# EAGLE schematic Mezzanine_Battery (EAGLE 6.5.0)

## Sheet 1 of 2
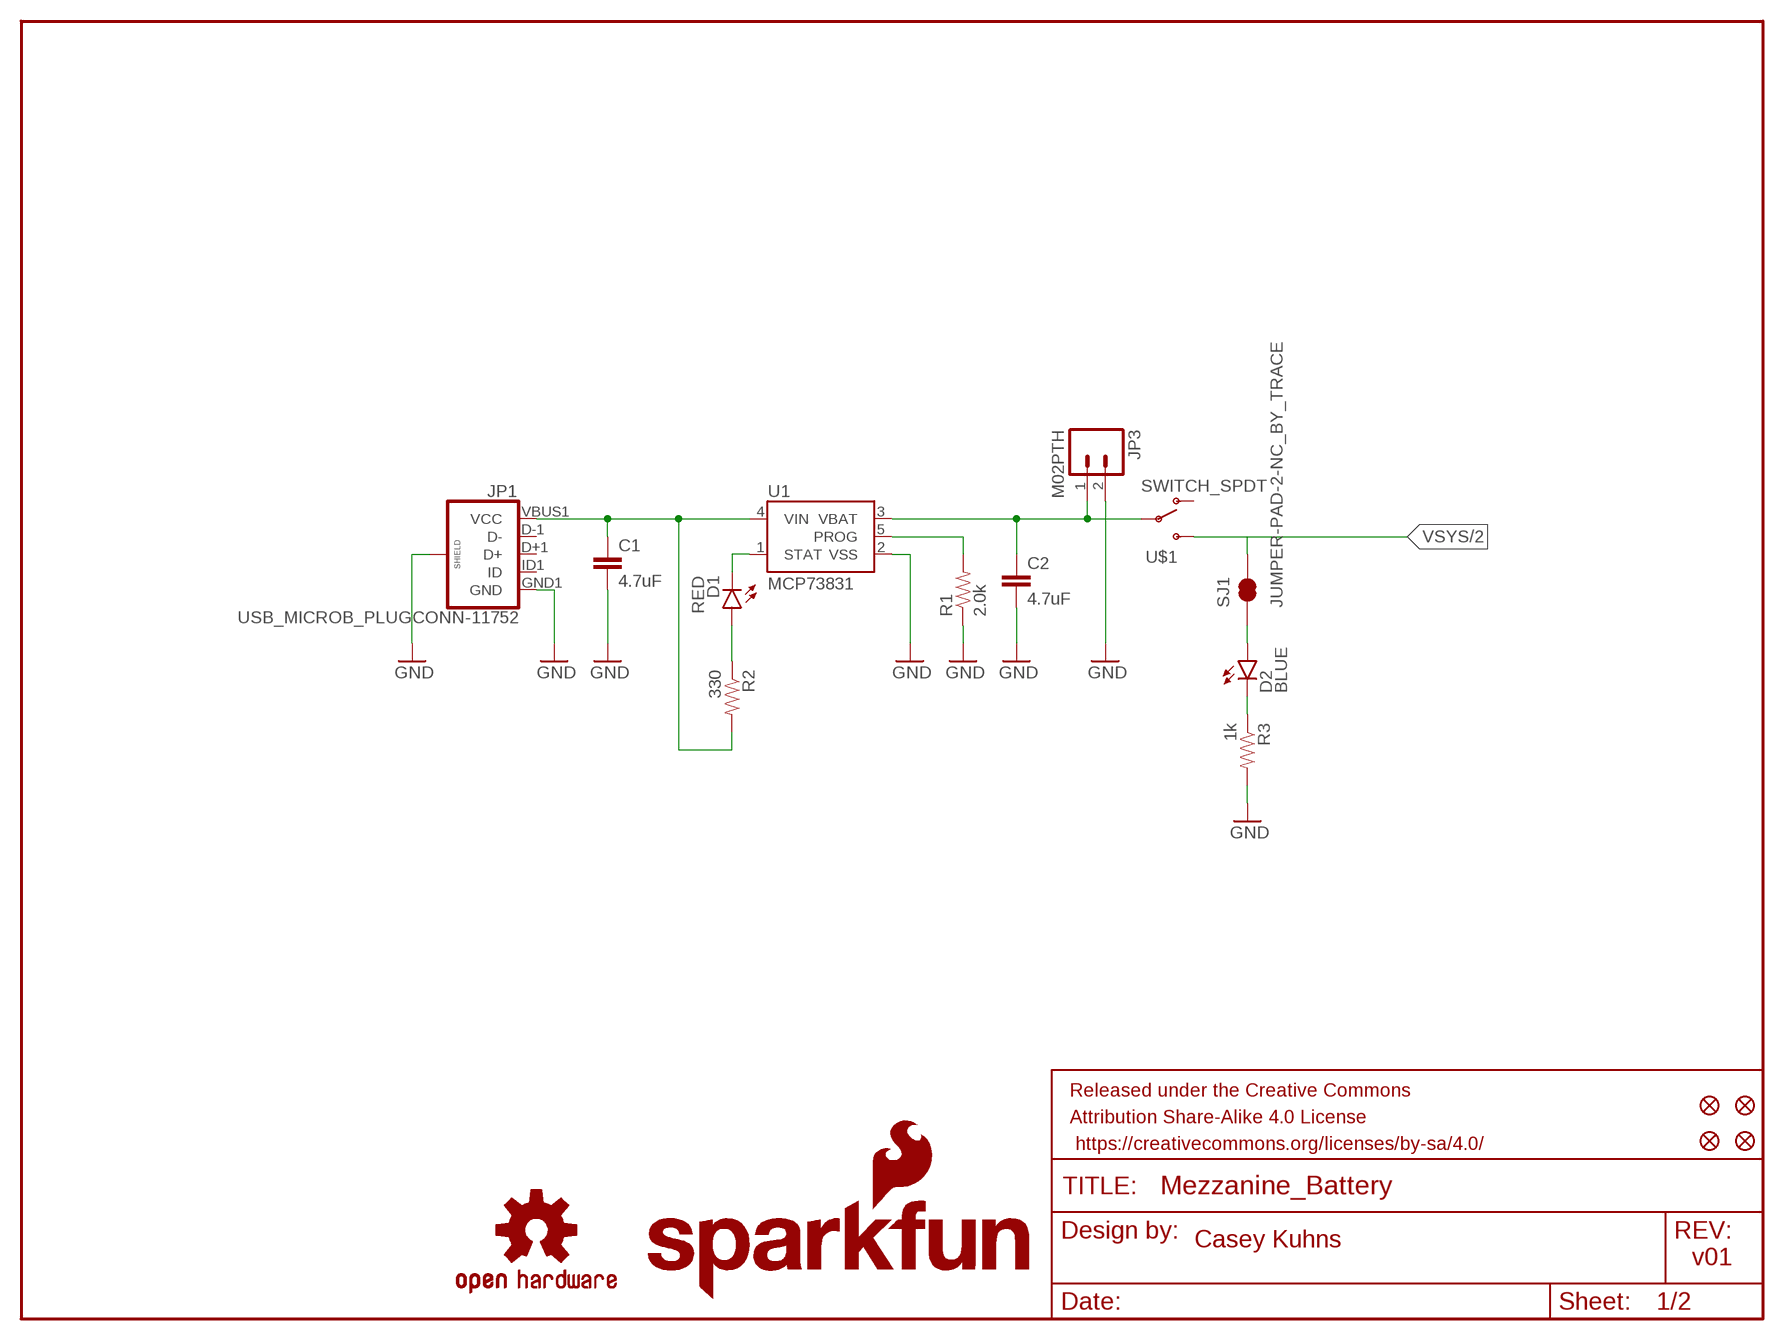
[diagram p0: schematic, sheet 1]

### Parts
C1  4.7uF  4.7UF-6.3V-10%(0603)0603  [0603-CAP]
C2  4.7uF  4.7UF-6.3V-10%(0603)0603  [0603-CAP]
D1  RED  LED-RED0603  [LED-0603]
D2  BLUE  LED-BLUE0603  [LED-0603]
FID1  FIDUCIAL1X2  [FIDUCIAL-1X2]
FID2  FIDUCIAL1X2  [FIDUCIAL-1X2]
FID3  FIDUCIAL1X2  [FIDUCIAL-1X2]
FID4  FIDUCIAL1X2  [FIDUCIAL-1X2]
FRAME1  FRAME-LETTER  [CREATIVE_COMMONS]
JP1  USB_MICROB_PLUGCONN-11752  [USB-B-MICRO-SMD_V03]
JP3  M02PTH  [1X02]
LOGO1  OSHW-LOGOS  [OSHW-LOGO-S]
LOGO4  SFE_LOGO_NAME_FLAME.1_INCH  [SFE_LOGO_NAME_FLAME_.1]
R1  2.0k  2.0KOHM1/10W5%(0603)  [0603-RES]
R2  330  330OHM1/10W1%(0603)  [0603-RES]
R3  1k  1KOHM1/10W1%(0603)  [0603-RES]
SJ1  JUMPER-PAD-2-NC_BY_TRACE  [PAD-JUMPER-2-NC_BY_TRACE_YES_SILK]
U1  MCP73831  [SOT23-5]
U$1  SWITCH_SPDT  [KPS-1290]

### Nets
GND: C1.2 C2.2 JP1.GND1(GND) JP1.SHIELD1(SHIELD) JP1.SHIELD2(SHIELD) JP1.SHIELD3(SHIELD) JP3.2 R1.1 R3.2 U1.2(VSS) ; also sheet 2
N$1: C1.1 JP1.VBUS1(VCC) R2.2 U1.4(VIN)
N$2: D2.C R3.1
N$3: R1.2 U1.5(PROG)
N$4: D1.A R2.1
N$5: D1.C U1.1(STAT)
N$6: C2.1 JP3.1 U1.3(VBAT) U$1.P
N$7: D2.A SJ1.1
VSYS: SJ1.2 U$1.S ; also sheet 2
Unconnected: JP1.D+1(D+) JP1.D-1(D-) JP1.ID1(ID) U$1.O

### Notes on the sheet
- Casey Kuhns
- v01

## Sheet 2 of 2
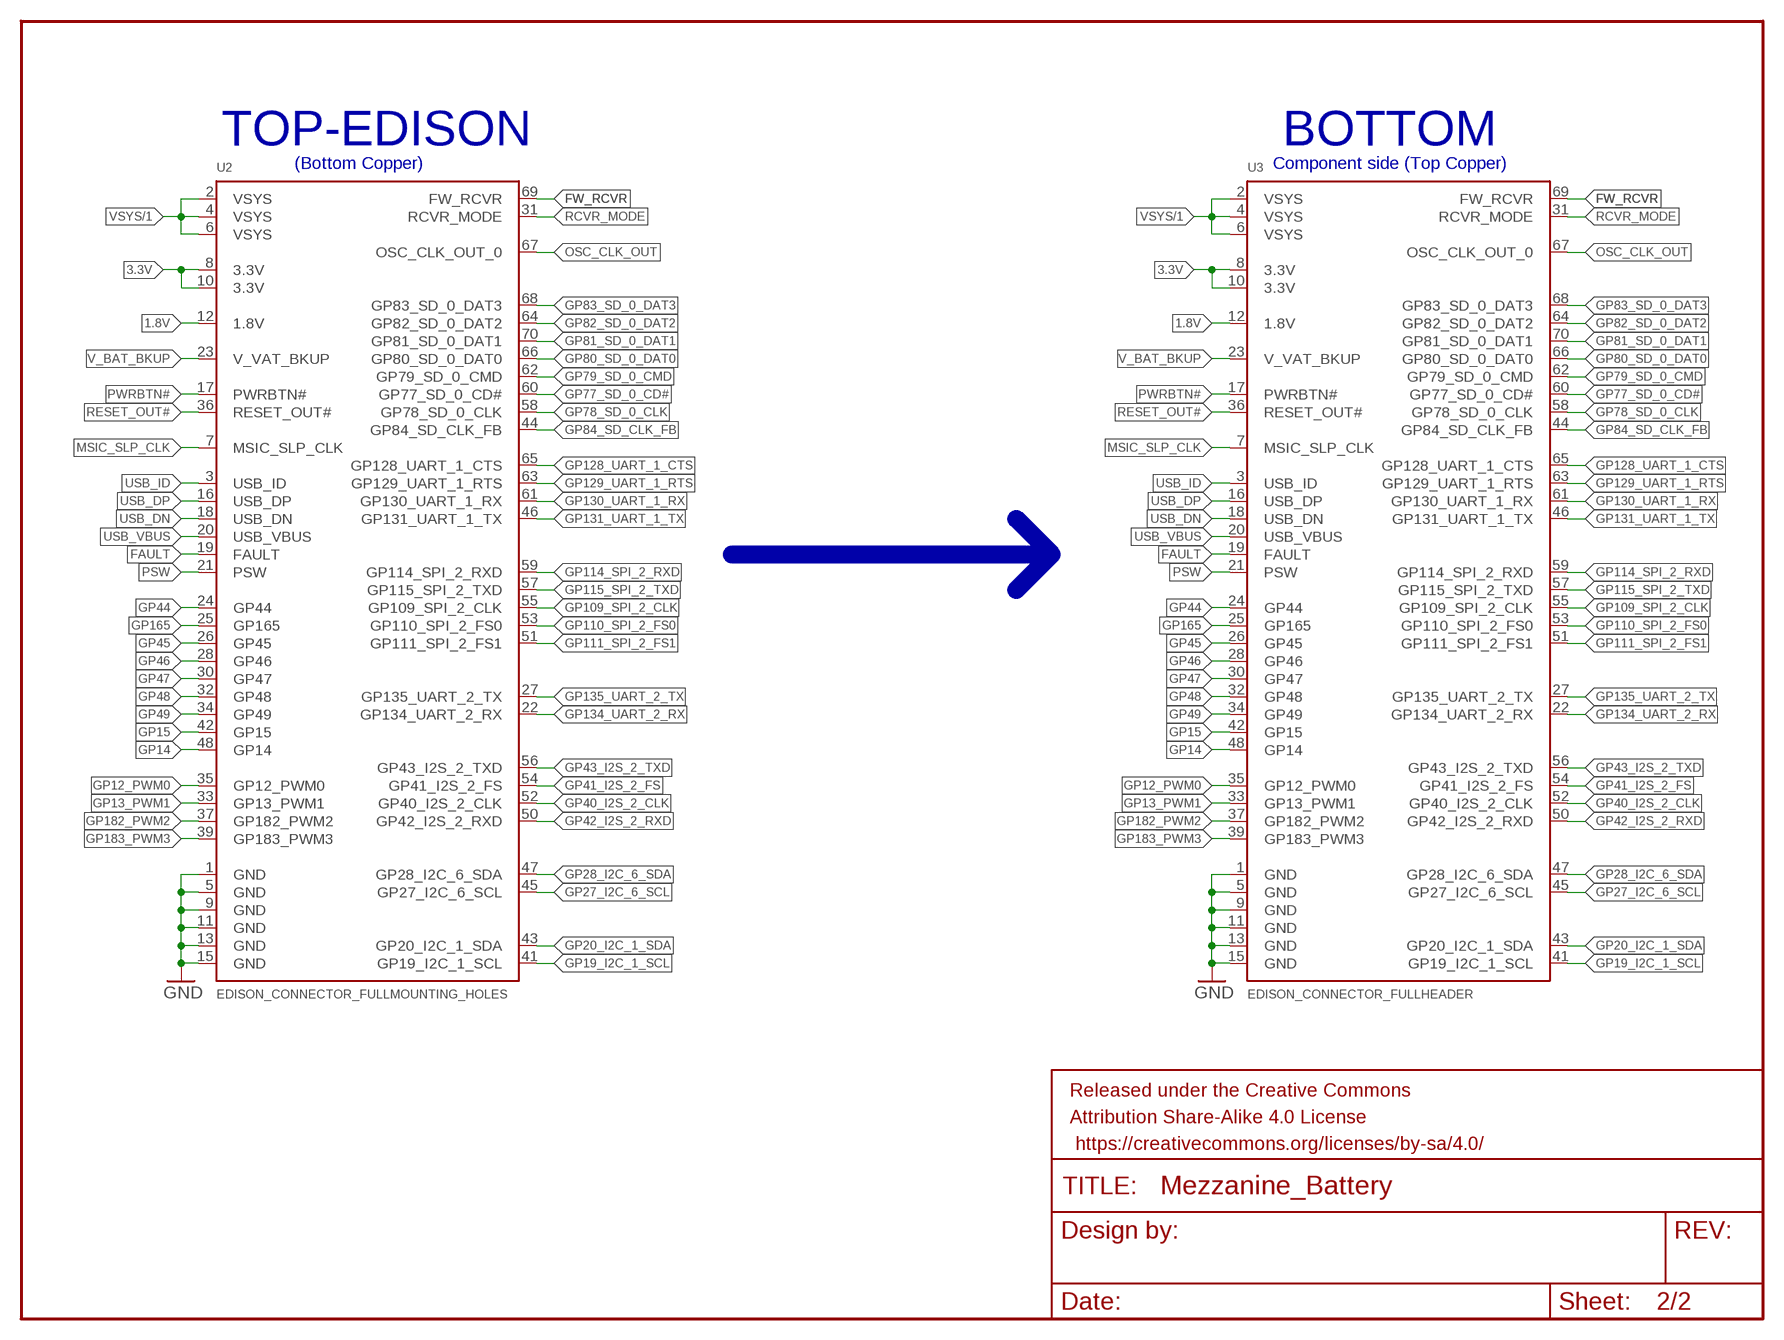
[diagram p1: schematic, sheet 2]

### Parts
FRAME2  FRAME-LETTER  [CREATIVE_COMMONS]
U2  EDISON_CONNECTOR_FULLMOUNTING_HOLES  [EDISON_DAUGHTER]
U3  EDISON_CONNECTOR_FULLHEADER  [DF40C-70DP-0.4(51)]

### Nets
1.8V: U2.12(1.8V) U3.12(1.8V)
3.3V: U2.8(3.3V) U2.10(3.3V) U3.8(3.3V) U3.10(3.3V)
FAULT: U2.19(FAULT) U3.19(FAULT)
FW_RCVR: U2.69(FW_RCVR) U3.69(FW_RCVR)
GND: U2.1(GND) U2.5(GND) U2.9(GND) U2.11(GND) U2.13(GND) U2.15(GND) U3.1(GND) U3.5(GND) U3.9(GND) U3.11(GND) U3.13(GND) U3.15(GND) ; also sheet 1
GP12_PWM0: U2.35(GP12_PWM0) U3.35(GP12_PWM0)
GP13_PWM1: U2.33(GP13_PWM1) U3.33(GP13_PWM1)
GP14: U2.48(GP14) U3.48(GP14)
GP15: U2.42(GP15) U3.42(GP15)
GP19_I2C_1_SCL: U2.41(GP19_I2C_1_SCL) U3.41(GP19_I2C_1_SCL)
GP20_I2C_1_SDA: U2.43(GP20_I2C_1_SDA) U3.43(GP20_I2C_1_SDA)
GP27_I2C_6_SCL: U2.45(GP27_I2C_6_SCL) U3.45(GP27_I2C_6_SCL)
GP28_I2C_6_SDA: U2.47(GP28_I2C_6_SDA) U3.47(GP28_I2C_6_SDA)
GP40_I2S_2_CLK: U2.52(GP40_I2S_2_CLK) U3.52(GP40_I2S_2_CLK)
GP41_I2S_2_FS: U2.54(GP41_I2S_2_FS) U3.54(GP41_I2S_2_FS)
GP42_I2S_2_RXD: U2.50(GP42_I2S_2_RXD) U3.50(GP42_I2S_2_RXD)
GP43_I2S_2_TXD: U2.56(GP43_I2S_2_TXD) U3.56(GP43_I2S_2_TXD)
GP44: U2.24(GP44) U3.24(GP44)
GP45: U2.26(GP45) U3.26(GP45)
GP46: U2.28(GP46) U3.28(GP46)
GP47: U2.30(GP47) U3.30(GP47)
GP48: U2.32(GP48) U3.32(GP48)
GP49: U2.34(GP49) U3.34(GP49)
GP77_SD_0_CD#: U2.60(GP77_SD_0_CD#) U3.60(GP77_SD_0_CD#)
GP78_SD_0_CLK: U2.58(GP78_SD_0_CLK) U3.58(GP78_SD_0_CLK)
GP79_SD_0_CMD: U2.62(GP79_SD_0_CMD) U3.62(GP79_SD_0_CMD)
GP80_SD_0_DAT0: U2.66(GP80_SD_0_DAT0) U3.66(GP80_SD_0_DAT0)
GP81_SD_0_DAT1: U2.70(GP81_SD_0_DAT1) U3.70(GP81_SD_0_DAT1)
GP82_SD_0_DAT2: U2.64(GP82_SD_0_DAT2) U3.64(GP82_SD_0_DAT2)
GP83_SD_0_DAT3: U2.68(GP83_SD_0_DAT3) U3.68(GP83_SD_0_DAT3)
GP84_SD_CLK_FB: U2.44(GP84_SD_CLK_FB) U3.44(GP84_SD_CLK_FB)
GP109_SPI_2_CLK: U2.55(GP109_SPI_2_CLK) U3.55(GP109_SPI_2_CLK)
GP110_SPI_2_FS0: U2.53(GP110_SPI_2_FS0) U3.53(GP110_SPI_2_FS0)
GP111_SPI_2_FS1: U2.51(GP111_SPI_2_FS1) U3.51(GP111_SPI_2_FS1)
GP114_SPI_2_RXD: U2.59(GP114_SPI_2_RXD) U3.59(GP114_SPI_2_RXD)
GP115_SPI_2_TXD: U2.57(GP115_SPI_2_TXD) U3.57(GP115_SPI_2_TXD)
GP128_UART_1_CTS: U2.65(GP128_UART_1_CTS) U3.65(GP128_UART_1_CTS)
GP129_UART_1_RTS: U2.63(GP129_UART_1_RTS) U3.63(GP129_UART_1_RTS)
GP130_UART_1_RX: U2.61(GP130_UART_1_RX) U3.61(GP130_UART_1_RX)
GP131_UART_1_TX: U2.46(GP131_UART_1_TX) U3.46(GP131_UART_1_TX)
GP134_UART_2_RX: U2.22(GP134_UART_2_RX) U3.22(GP134_UART_2_RX)
GP135_UART_2_TX: U2.27(GP135_UART_2_TX) U3.27(GP135_UART_2_TX)
GP165: U2.25(GP165) U3.25(GP165)
GP182_PWM2: U2.37(GP182_PWM2) U3.37(GP182_PWM2)
GP183_PWM3: U2.39(GP183_PWM3) U3.39(GP183_PWM3)
MSIC_SLP_CLK: U2.7(MSIC_SLP_CLK) U3.7(MSIC_SLP_CLK)
OSC_CLK_OUT: U2.67(OSC_CLK_OUT_0) U3.67(OSC_CLK_OUT_0)
PSW: U2.21(PSW) U3.21(PSW)
PWRBTN#: U2.17(PWRBTN#) U3.17(PWRBTN#)
RCVR_MODE: U2.31(RCVR_MODE) U3.31(RCVR_MODE)
RESET_OUT#: U2.36(RESET_OUT#) U3.36(RESET_OUT#)
USB_DN: U2.18(USB_DN) U3.18(USB_DN)
USB_DP: U2.16(USB_DP) U3.16(USB_DP)
USB_ID: U2.3(USB_ID) U3.3(USB_ID)
USB_VBUS: U2.20(USB_VBUS) U3.20(USB_VBUS)
V_BAT_BKUP: U2.23(V_VAT_BKUP) U3.23(V_VAT_BKUP)
VSYS: U2.2(VSYS) U2.4(VSYS) U2.6(VSYS) U3.2(VSYS) U3.4(VSYS) U3.6(VSYS) ; also sheet 1

### Buses
B$1

### Notes on the sheet
- TOP-EDISON | BOTTOM
- (Bottom Copper) | Component side (Top Copper)

## Library data of the parts
C1 C2 = SparkFun-Capacitors:4.7UF-6.3V-10%(0603): CAP-08280; PROD_ID: CAP-08280
D1 = SparkFun-LED:LED-RED: Assorted Red LEDs LilyPad 1206- DIO-09912 1206- DIO-00809 0603- DIO-00819; PROD_ID: DIO-00819
D2 = SparkFun-LED:LED-BLUE: Blue LEDs for production use Various blue LEDs stocked by SparkFun production 0603 - DIO-08575 Rebel - DIO-09553 1206 - DIO-09911; PROD_ID: DIO-08575
FID1-FID4 = SparkFun-Aesthetics:FIDUCIAL: Fiducial Alignment Points Various fiducial points for machine vision alignment.
FRAME1 FRAME2 = SparkFun-Aesthetics:FRAME-LETTER: Schematic Frame Standard 8.5x11 US Letter frame
JP1 = SparkFun-Connectors:USB_MICROB_PLUG: USB Micro-B connectors Some male, some female. Watch your step!; PROD_ID: CONN-11752
JP3 = SparkFun-Connectors:M02: Standard 2-pin 0.1" header. Use with - straight break away headers ( PRT-00116) - right angle break away headers (PRT-00553) - swiss pins (PRT-00743) - machine pins (PRT-00117) - female headers (PRT-00115) Molex polarized connector foot print use with: PRT-08233 with associated crimp pins and housings. 2.54_SCREWTERM for use with PRT-10571. 3.5mm Screw Terminal footprints for PRT-08084 5mm Screw Terminal footprints for use with PRT-08432
LOGO1 = SparkFun-Aesthetics:OSHW-LOGO: Open Source Hardware Logo This logo indicates the piece of hardware it is found on incorporates a OSHW license and/or adheres to the definition of open source hardware found here: http://freedomdefined.org/OSHW
LOGO4 = SparkFun-Aesthetics:SFE_LOGO_NAME_FLAME: SFE Logo, name and flame This is the SparkFun full logo. The logo on the schematic will always be the same size; the package variant is the height of the flame part of the logo. Default layer for the logo on the board is tSilk.
R1 = SparkFun-Resistors:2.0KOHM1/10W5%(0603): RES-08296; PROD_ID: RES-08296
R2 = SparkFun-Resistors:330OHM1/10W1%(0603): RES-00818; PROD_ID: RES-00818
R3 = SparkFun-Resistors:1KOHM1/10W1%(0603): RES-07856; PROD_ID: RES-07856; VALUE: 1K
SJ1 = SparkFun-Passives:JUMPER-PAD-2-NC_BY_TRACE
U1 = SparkFun-PowerIC:MCP73831: Miniature single cell, fully integrated Li-Ion, Li-polymer charge management controller http://ww1.microchip.com/downloads/en/DeviceDoc/21984a.pdf IC-09995; PROD_ID: IC-09995
U2 U3 = Edison:EDISON_CONNECTOR_FULL
U$1 = SparkFun-Electromechanical:SWITCH_SPDT: SWCH-10651 Side-actuated SPDT slide switch, as used on the Arduino Pro; PROD_ID: SWCH-10651